# Altium schematic sheet MAX485.SchDoc
size A4; SheetNumber: 8; SheetTotal: 10
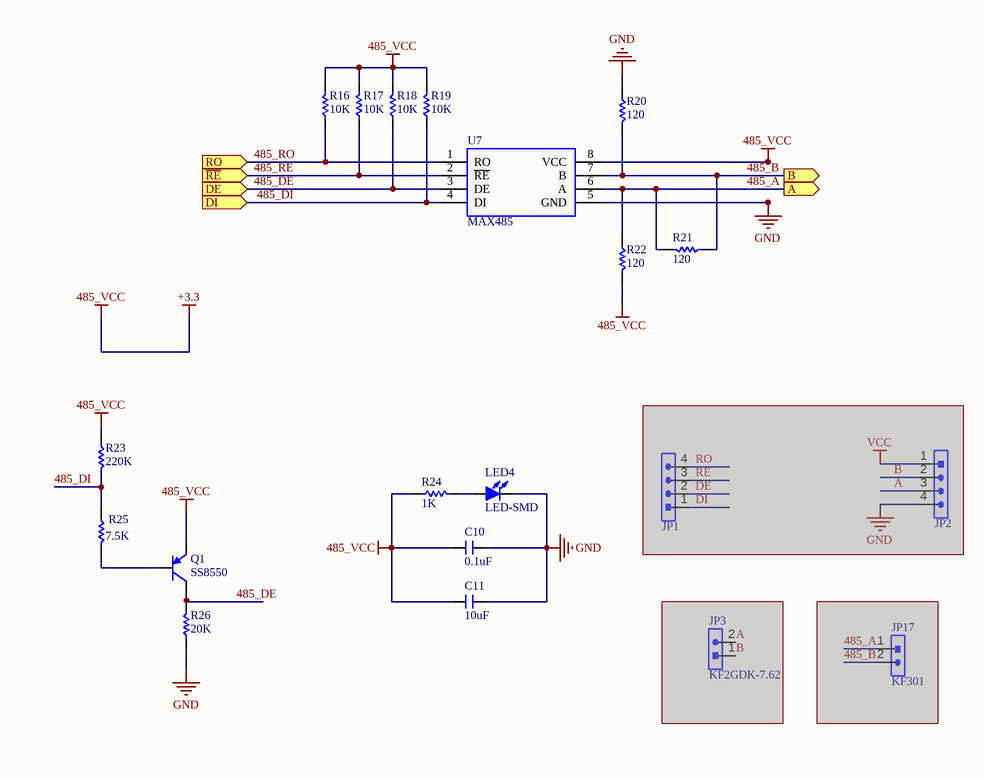
[diagram p0: MAX485.SchDoc]

## Parts
C10  0.1uF  [C 0805]
C11  10uF  [C 1206]
JP1  HDR-1X4  [HDR-1X4]  (value not drawn)  (masked out: inside a compile mask, not in the netlist)
JP2  HDR-1X4  [HDR-1X4]  (value not drawn)  (masked out: inside a compile mask, not in the netlist)
JP3  KF2GDK-7.62  [KF2EDGK-2P_H_7.62]  (masked out: inside a compile mask, not in the netlist)
JP17  KF301  [KF301-2P]  (masked out: inside a compile mask, not in the netlist)
LED4  LED-SMD  [LED 0805R]
Q1  SS8550  [SOT23-3N]
R16  10K  [R 0805]
R17  10K  [R 0805]
R18  10K  [R 0805]
R19  10K  [R 0805]
R20  120  [R 0805]
R21  120  [R 0805]
R22  120  [R 0805]
R23  220K  [R 0805]
R24  1K  [R 0805]
R25  7.5K  [R 0805]
R26  20K  [R 0805]
U7  MAX485  [SOP8_N]

## Ports
A (out), B (out), DE (in), DI (in), RO (in), ~{RE} (in)

## Nets
+3.3: C10.1 C11.1 Q1.2(E) R16.2 R17.2 R18.2 R19.2 R22.2 R23.1 R24.1 U7.8(VCC)  [also labelled 485_VCC]
GND: C10.2 C11.2 LED4.2(K) R20.1 R26.1 U7.5(GND)
485_A: R21.2 R22.1 U7.6(A) ; port A
485_B: R20.2 R21.1 U7.7(B) ; port B
485_DE: Q1.3(C) R18.1 R26.2 U7.3(DE) ; port DE
485_DI: R19.1 R23.2 R25.1 U7.4(DI) ; port DI
485_~{RE}: R17.1 U7.2(~{RE}) ; port ~{RE}
485_RO: R16.1 U7.1(RO) ; port RO
NetLED4_1: LED4.1(A) R24.2
NetQ1_1: Q1.1(B) R25.2

## Library data of the parts
C10 C11 = C: Non-polar patch capacitor; BOM名称: 无极性贴片电容; 版权归属: 源创客; 学习资源: www.ooocke.com
JP1 JP2 = Header 4: 4P Connector; BOM名称: 4P接插件; 版权归属: 源创客; 学习资源: www.ooocke.com
JP3 JP17 = Header 2: 2P Connector; BOM名称: 2P接插件; 版权归属: 源创客; 学习资源: www.ooocke.com
LED4 = LED-SMD: Patch LED; BOM名称: 贴片LED; 版权归属: 源创客; 学习资源: www.ooocke.com
Q1 = 8550-SMD: High Frequency Amplifier-PNP; BOM名称: 高频放大-PNP型; 版权归属: 源创客; 属性: 40V 1.5A 1W 100MHZ; 学习资源: www.ooocke.com
R16-R26 = R: Chip resistor; 版权归属: 源创客; BOM名称: Chip resistor; 学习资源: www.ooocke.com
U7 = MAX485: RS485/RS422 Transceivers; BOM名称: MAX232; 版权归属: 源创客; 学习资源: www.ooocke.com